# EAGLE schematic trial (EAGLE 9.1.2)
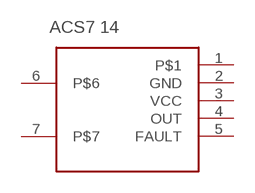
[diagram p0: schematic, sheet 1]

## Parts
U$1  ACS714EGHII-ACS714  [ACS714E]
Unconnected: U$1.1 U$1.2(GND) U$1.3(VCC) U$1.4(OUT) U$1.5(FAULT) U$1.6 U$1.7

## Library data of the parts
U$1 = Current  senosor:ACS714E